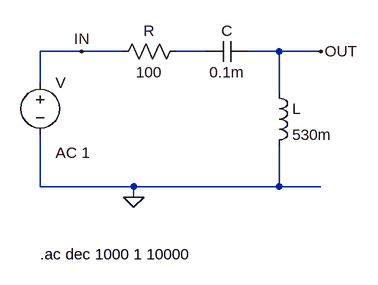
[diagram p0: schematic 02 RLC-Filter.asc]
02 RLC-Filter.asc, the LTspice schematic file:
Version 4
SHEET 1 880 680
WIRE -32 128 -96 128
WIRE 32 128 -32 128
WIRE 160 128 112 128
WIRE 272 128 224 128
WIRE 336 128 272 128
WIRE -96 176 -96 128
WIRE 272 192 272 128
WIRE -96 336 -96 256
WIRE 48 336 -96 336
WIRE 272 336 272 272
WIRE 272 336 48 336
WIRE 336 336 272 336
WIRE 48 352 48 336
FLAG 48 352 0
FLAG -32 128 IN
FLAG 336 128 OUT
SYMBOL res 128 112 R90
WINDOW 0 0 56 VBottom 2
WINDOW 3 32 56 VTop 2
SYMATTR InstName R
SYMATTR Value 100
SYMBOL ind 256 176 R0
SYMATTR InstName L
SYMATTR Value 530m
SYMBOL voltage -96 160 R0
WINDOW 123 24 124 Left 2
WINDOW 39 0 0 Left 0
SYMATTR Value2 AC 1
SYMATTR InstName V
SYMATTR Value ""
SYMBOL cap 224 112 R90
WINDOW 0 0 32 VBottom 2
WINDOW 3 32 32 VTop 2
SYMATTR InstName C
SYMATTR Value 0.1m
TEXT -96 440 Left 2 !.ac dec 1000 1 10000

The netlist it stands for:
* 02 RLC-Filter.asc
R N001 IN 100
L OUT 0 530m
V IN 0 AC 1
C OUT N001 0.1m
.ac dec 1000 1 10000
.backanno
.end